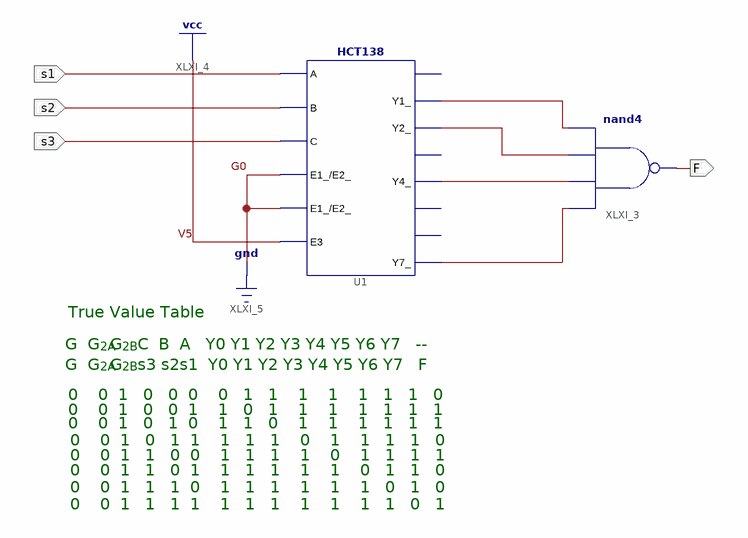
[diagram p0: schematic sheet 1]
// Xilinx ISE schematic Lamp_74HC138.sch (kintex7) as structural Verilog: 2 symbols, 4 ports
module Lamp_74HC138 (
  input  s1,
  input  s2,
  input  s3,
  output F
);

  wire XLXN_5, XLXN_6, XLXN_8, XLXN_9;

  nand XLXI_3 (F, XLXN_9, XLXN_8, XLXN_6, XLXN_5);
  HCT138 U1 (
    .E1_(1'b0), .E2_(1'b0), .E3(1'b1), .Y1_(XLXN_5), .Y2_(XLXN_6), .Y4_(XLXN_8), .Y7_(XLXN_9), .C(s3),
    .A(s1), .B(s2));  // open: Y0_, Y3_, Y5_, Y6_

  // Notes on the sheet:
  //   True Value Table
  //   G  G  G   C  B  A   Y0 Y1 Y2 Y3 Y4 Y5 Y6 Y7   --
  //   2A
  //   2B
  //   G  G  G   s3 s2s1  Y0 Y1 Y2 Y3 Y4 Y5 Y6 Y7   F
  //   2A
  //   2B
  //   0    0  1   0   0  0    0   1   1    1    1    1   1   1   0
  //   0    0  1   0   0  1    1   0   1    1    1    1   1   1   1
  //   0    0  1   0   1  0    1   1   0    1    1    1   1   1   1
  //   0    0  1   0   1  1    1   1   1    0    1    1   1   1   0
  //   0    0  1   1   0  0    1   1   1    1    0    1   1   1   1
  //   0    0  1   1   0  1    1   1   1    1    1    0   1   1   0
  //   0    0  1   1   1  0    1   1   1    1    1    1   0   1   0
  //   0    0  1   1   1  1    1   1   1    1    1    1   1   0   1
endmodule
